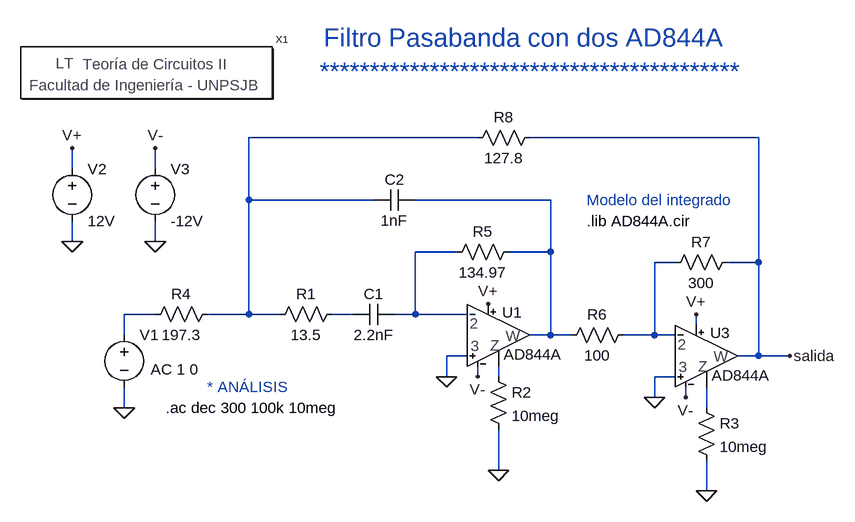
[diagram p0: schematic Filtro pasabanda con dos AD844.asc]
Filtro pasabanda con dos AD844.asc, the LTspice schematic file:
Version 4
SHEET 1 916 680
WIRE 128 -160 -224 -160
WIRE 560 -160 208 -160
WIRE -496 -112 -496 -144
WIRE -368 -112 -368 -144
WIRE -224 -64 -224 -160
WIRE -32 -64 -224 -64
WIRE 240 -64 32 -64
WIRE -496 0 -496 -32
WIRE -368 0 -368 -32
WIRE 96 16 32 16
WIRE 240 16 240 -64
WIRE 240 16 176 16
WIRE 432 32 400 32
WIRE 560 32 560 -160
WIRE 560 32 512 32
WIRE -368 112 -416 112
WIRE -224 112 -224 -64
WIRE -224 112 -288 112
WIRE -176 112 -224 112
WIRE -64 112 -96 112
WIRE 32 112 32 16
WIRE 32 112 0 112
WIRE 112 112 32 112
WIRE 464 128 464 112
WIRE -416 144 -416 112
WIRE 240 144 240 16
WIRE 240 144 208 144
WIRE 272 144 240 144
WIRE 400 144 400 32
WIRE 400 144 352 144
WIRE 432 144 400 144
WIRE 112 176 80 176
WIRE 560 176 560 32
WIRE 560 176 528 176
WIRE 608 176 560 176
WIRE 80 208 80 176
WIRE 128 208 128 192
WIRE 160 208 160 192
WIRE 432 208 400 208
WIRE 400 240 400 208
WIRE 448 240 448 224
WIRE -416 256 -416 224
WIRE 480 256 480 224
WIRE 160 352 160 288
WIRE 480 384 480 336
FLAG 144 96 V+
FLAG 128 208 V-
FLAG -416 256 0
FLAG -368 0 0
FLAG -496 0 0
FLAG -496 -144 V+
FLAG -368 -144 V-
FLAG 80 208 0
FLAG 160 352 0
FLAG 464 112 V+
FLAG 448 240 V-
FLAG 400 240 0
FLAG 480 384 0
FLAG 608 176 salida
SYMBOL res -384 128 R270
WINDOW 0 32 56 VTop 2
WINDOW 3 0 56 VBottom 2
SYMATTR InstName R4
SYMATTR Value 197.3
SYMBOL voltage -416 128 R0
WINDOW 3 -46 167 Left 2
WINDOW 123 41 69 Left 2
WINDOW 39 0 0 Left 2
SYMATTR Value ""
SYMATTR Value2 AC 1 0
SYMATTR InstName V1
SYMBOL voltage -496 -128 R0
SYMATTR InstName V2
SYMATTR Value 12V
SYMBOL voltage -368 -128 R0
SYMATTR InstName V3
SYMATTR Value -12V
SYMBOL res -80 96 R90
WINDOW 0 0 56 VBottom 2
WINDOW 3 32 56 VTop 2
SYMATTR InstName R1
SYMATTR Value 13.5
SYMBOL cap 0 96 R90
WINDOW 0 0 32 VBottom 2
WINDOW 3 32 32 VTop 2
SYMATTR InstName C1
SYMATTR Value 2.2nF
SYMBOL res 144 192 R0
SYMATTR InstName R2
SYMATTR Value 10meg
SYMBOL res 464 240 R0
SYMATTR InstName R3
SYMATTR Value 10meg
SYMBOL res 192 0 R90
WINDOW 0 0 56 VBottom 2
WINDOW 3 32 56 VTop 2
SYMATTR InstName R5
SYMATTR Value 134.97
SYMBOL res 368 128 R90
WINDOW 0 0 56 VBottom 2
WINDOW 3 32 56 VTop 2
SYMATTR InstName R6
SYMATTR Value 100
SYMBOL res 528 16 R90
WINDOW 0 0 56 VBottom 2
WINDOW 3 32 56 VTop 2
SYMATTR InstName R7
SYMATTR Value 300
SYMBOL res 224 -176 R90
WINDOW 0 0 56 VBottom 2
WINDOW 3 32 56 VTop 2
SYMATTR InstName R8
SYMATTR Value 127.8
SYMBOL cap 32 -80 R90
WINDOW 0 0 32 VBottom 2
WINDOW 3 32 32 VTop 2
SYMATTR InstName C2
SYMATTR Value 1nF
SYMBOL Circuitos2\\Transferidor\\ad844a 144 96 R0
SYMATTR InstName U1
SYMBOL Circuitos2\\Transferidor\\ad844a 464 128 R0
SYMATTR InstName U3
SYMBOL Circuitos2\\Letreros\\Teoría\ de\ Circuitos\ II -384 -256 R0
SYMATTR InstName X1
TEXT -352 256 Left 2 !.ac dec 300 100k 10meg
TEXT 200 -288 Center 4 ;Filtro Pasabanda con dos AD844A\n******************************************
TEXT 296 -32 Left 2 !.lib AD844A.cir
TEXT 296 -64 Left 2 ;Modelo del integrado
TEXT -288 224 Left 2 ;* ANÁLISIS

The netlist it stands for:
* Filtro pasabanda con dos AD844.asc
R4 N005 N001 197.3
V1 N005 0 AC 1 0
V2 V+ 0 12V
V3 V- 0 -12V
R1 N006 N001 13.5
C1 N003 N006 2.2nF
R2 N007 0 10meg
R3 N008 0 10meg
R5 N002 N003 134.97
R6 N004 N002 100
R7 salida N004 300
R8 salida N001 127.8
C2 N002 N001 1nF
XU1 0 N003 V+ V- N002 N007 ad844a AD844A  ; pins In+ In- V+ V- OUT COMP
XU3 0 N004 V+ V- salida N008 ad844a AD844A  ; pins In+ In- V+ V- OUT COMP
XX1 Teoría de Circuitos II
.ac dec 300 100k 10meg
* Filtro Pasabanda con dos AD844A
* ******************************************
.lib AD844A.cir
* Modelo del integrado
* * ANÁLISIS
.backanno
.end